# Altium project steering_wheel_unit.PrjPcb (part 2 of 2)

## Sheet io.SchDoc
size A2; SheetNumber: 3; SheetTotal: 4
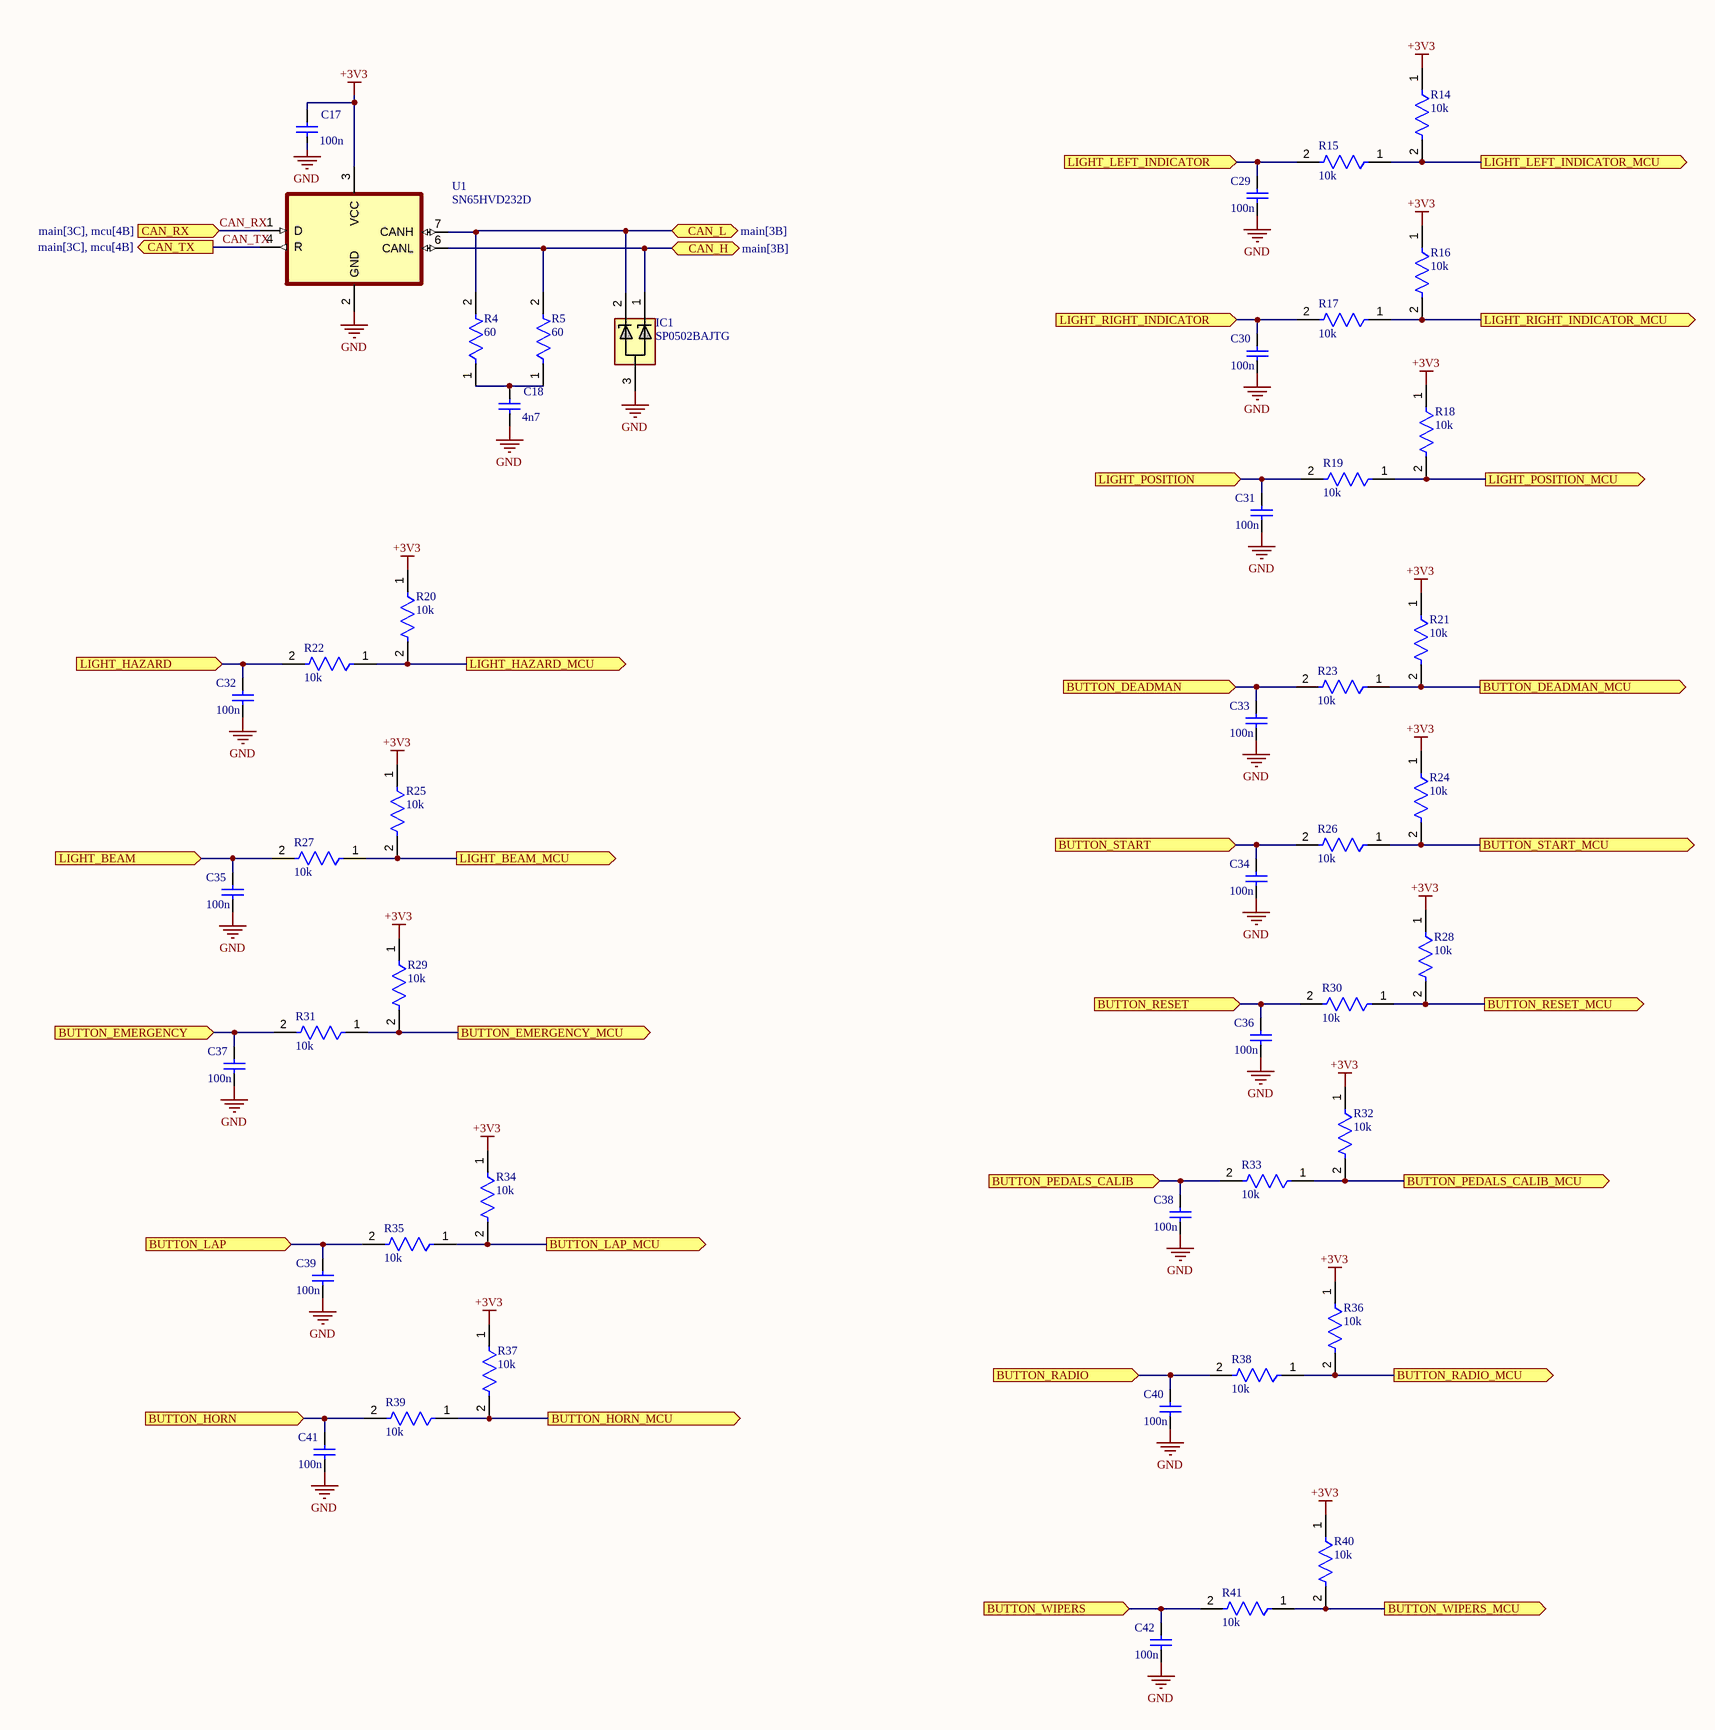
[diagram p2: io.SchDoc]

### Parts
C17  100n  [CAPC1206(3216)150_L]
C18  4n7  [CAPC1206(3216)150_L]
C29  100n  [CAPC1206(3216)150_L]
C30  100n  [CAPC1206(3216)150_L]
C31  100n  [CAPC1206(3216)150_L]
C32  100n  [CAPC1206(3216)150_L]
C33  100n  [CAPC1206(3216)150_L]
C34  100n  [CAPC1206(3216)150_L]
C35  100n  [CAPC1206(3216)150_L]
C36  100n  [CAPC1206(3216)150_L]
C37  100n  [CAPC1206(3216)150_L]
C38  100n  [CAPC1206(3216)150_L]
C39  100n  [CAPC1206(3216)150_L]
C40  100n  [CAPC1206(3216)150_L]
C41  100n  [CAPC1206(3216)150_L]
C42  100n  [CAPC1206(3216)150_L]
IC1  SP0502BAJTG  [SOT132P220X110-3N]
R4  60  [FP-RK73H2B-MFG]
R5  60  [FP-RK73H2B-MFG]
R14  10k  [FP-RK73H2B-MFG]
R15  10k  [FP-RK73H2B-MFG]
R16  10k  [FP-RK73H2B-MFG]
R17  10k  [FP-RK73H2B-MFG]
R18  10k  [FP-RK73H2B-MFG]
R19  10k  [FP-RK73H2B-MFG]
R20  10k  [FP-RK73H2B-MFG]
R21  10k  [FP-RK73H2B-MFG]
R22  10k  [FP-RK73H2B-MFG]
R23  10k  [FP-RK73H2B-MFG]
R24  10k  [FP-RK73H2B-MFG]
R25  10k  [FP-RK73H2B-MFG]
R26  10k  [FP-RK73H2B-MFG]
R27  10k  [FP-RK73H2B-MFG]
R28  10k  [FP-RK73H2B-MFG]
R29  10k  [FP-RK73H2B-MFG]
R30  10k  [FP-RK73H2B-MFG]
R31  10k  [FP-RK73H2B-MFG]
R32  10k  [FP-RK73H2B-MFG]
R33  10k  [FP-RK73H2B-MFG]
R34  10k  [FP-RK73H2B-MFG]
R35  10k  [FP-RK73H2B-MFG]
R36  10k  [FP-RK73H2B-MFG]
R37  10k  [FP-RK73H2B-MFG]
R38  10k  [FP-RK73H2B-MFG]
R39  10k  [FP-RK73H2B-MFG]
R40  10k  [FP-RK73H2B-MFG]
R41  10k  [FP-RK73H2B-MFG]
U1  SN65HVD232D  [SN65HVD232D]

### Ports
BUTTON_DEADMAN (in), BUTTON_DEADMAN_MCU (out), BUTTON_EMERGENCY (in), BUTTON_EMERGENCY_MCU (out), BUTTON_HORN (in), BUTTON_HORN_MCU (out), BUTTON_LAP (in), BUTTON_LAP_MCU (out), BUTTON_PEDALS_CALIB (in), BUTTON_PEDALS_CALIB_MCU (out), BUTTON_RADIO (in), BUTTON_RADIO_MCU (out), BUTTON_RESET (in), BUTTON_RESET_MCU (out), BUTTON_START (in), BUTTON_START_MCU (out), BUTTON_WIPERS (in), BUTTON_WIPERS_MCU (out), CAN_H (bidir, see main[3B]), CAN_L (bidir, see main[3B]), CAN_RX (in, see main[3C], mcu[4B]), CAN_TX (out, see main[3C], mcu[4B]), LIGHT_BEAM (in), LIGHT_BEAM_MCU (out), LIGHT_HAZARD (in), LIGHT_HAZARD_MCU (out), LIGHT_LEFT_INDICATOR (in), LIGHT_LEFT_INDICATOR_MCU (out), LIGHT_POSITION (in), LIGHT_POSITION_MCU (out), LIGHT_RIGHT_INDICATOR (in), LIGHT_RIGHT_INDICATOR_MCU (out)

### Nets
+3V3: C17.1 R14.1 R16.1 R18.1 R20.1 R21.1 R24.1 R25.1 R28.1 R29.1 R32.1 R34.1 R36.1 R37.1 R40.1 U1.3(VCC)
GND: C17.2 C18.2 C29.2 C30.2 C31.2 C32.2 C33.2 C34.2 C35.2 C36.2 C37.2 C38.2 C39.2 C40.2 C41.2 C42.2 IC1.3 U1.2(GND)
BUTTON_DEADMAN: C33.1 R23.2 ; port BUTTON_DEADMAN
BUTTON_EMERGENCY: C37.1 R31.2 ; port BUTTON_EMERGENCY
BUTTON_HORN: C41.1 R39.2 ; port BUTTON_HORN
BUTTON_LAP: C39.1 R35.2 ; port BUTTON_LAP
BUTTON_PEDALS_CALIB: C38.1 R33.2 ; port BUTTON_PEDALS_CALIB
BUTTON_RADIO: C40.1 R38.2 ; port BUTTON_RADIO
BUTTON_RESET: C36.1 R30.2 ; port BUTTON_RESET
BUTTON_START: C34.1 R26.2 ; port BUTTON_START
BUTTON_WIPERS: C42.1 R41.2 ; port BUTTON_WIPERS
CAN_H: IC1.1 R5.2 U1.6(CANL) ; port CAN_H
CAN_L: IC1.2 R4.2 U1.7(CANH) ; port CAN_L
CAN_RX: U1.1(D) ; port CAN_RX
CAN_TX: U1.4(R) ; port CAN_TX
LIGHT_BEAM: C35.1 R27.2 ; port LIGHT_BEAM
LIGHT_HAZARD: C32.1 R22.2 ; port LIGHT_HAZARD
LIGHT_LEFT_INDICATOR: C29.1 R15.2 ; port LIGHT_LEFT_INDICATOR
LIGHT_POSITION: C31.1 R19.2 ; port LIGHT_POSITION
LIGHT_RIGHT_INDICATOR: C30.1 R17.2 ; port LIGHT_RIGHT_INDICATOR
NetB1_8: R20.2 R22.1 ; port LIGHT_HAZARD_MCU
NetB1_9: R25.2 R27.1 ; port LIGHT_BEAM_MCU
NetB1_10: R18.2 R19.1 ; port LIGHT_POSITION_MCU
NetB1_11: R16.2 R17.1 ; port LIGHT_RIGHT_INDICATOR_MCU
NetB1_12: R14.2 R15.1 ; port LIGHT_LEFT_INDICATOR_MCU
NetB1_28: R32.2 R33.1 ; port BUTTON_PEDALS_CALIB_MCU
NetB1_29: R37.2 R39.1 ; port BUTTON_HORN_MCU
NetB1_30: R34.2 R35.1 ; port BUTTON_LAP_MCU
NetB1_31: R28.2 R30.1 ; port BUTTON_RESET_MCU
NetB1_32: R24.2 R26.1 ; port BUTTON_START_MCU
NetB1_33: R21.2 R23.1 ; port BUTTON_DEADMAN_MCU
NetB1_34: R29.2 R31.1 ; port BUTTON_EMERGENCY_MCU
NetB1_41: R36.2 R38.1 ; port BUTTON_RADIO_MCU
NetB1_42: R40.2 R41.1 ; port BUTTON_WIPERS_MCU
NetC18_1: C18.1 R4.1 R5.1

### Notes on the sheet
- DWG. NO.
- REV.
- SHT.
- REVISION
- DESCRIPTION
- DATE
- APPROVED
- THIS DOCUMENT AND THE DATA DISCLOSED HEREIN OR HEREWITH IS THE PROPERTY OF ALTIUM LIMITED AND MAY BE FREELY DISTRIBUTED IN WHOLE. NO RIGHTS ARE RESERVED OR EXPRESS OR IMPLIED WARANTEE GIVEN.
- ENG:
- DSN:
- APPROVALS
- PROJECT
- DOCUMENT REVISION:
- DESIGN ITEM:
- CHK:
- BOM:
- REFERENCE DOCUMENTS
- PROJECT REVISION:
- TITLE
- FAB DWG:
- PCB DWG:
- ASSY DWG:
- SCALE:
- SIZE
- C
- CAGE CODE
- FILE NAME
- DWG NO.
- SHEET
- OF
- REV

### Library data of the parts
C17 C18 C29-C42 = CMP-1037-04778-1: CAP 1.8uF 10V ±5% 1206 (3216 Metric) Thickness 1.45mm SMD; Case-EIA: 1206; Tolerance: Â±5%; Case-Metric: 3216; Technology: SMT; Value: 1.8uF; Rated Voltage: 10 V; Max Thickness: 1.45 mm
IC1 = SP0502BAJTG: Integrated Circuit; Manufacturer_Name: LITTELFUSE; Datasheet Link: https://www.littelfuse.com/~/media/electronics/datasheets/tvs_diode_arrays/littelfuse_tvs_diode_array_sp05_datasheet.pdf.pdf; Height: 1.1mm; Manufacturer_Part_Number: SP0502BAJTG; Mouser Part Number: 576-SP0502BAJTG; Mouser Price/Stock: https://www.mouser.co.uk/ProductDetail/Littelfuse/SP0502BAJTG?qs=RnOBYWd%2Fz7cttN1Mwg4HWA%3D%3D; Arrow Part Number: SP0502BAJTG; Arrow Price/Stock: https://www.arrow.com/en/products/sp0502bajtg/littelfuse?region=nac
R4 R5 R14-R41 = CMP-04015-098385-1: 40.2kΩ ±1% 0.25W Chip Resistor 1206 Thick Film AEC-Q200 Qualified; Resistance: 40.2kR; Voltage Rating (DC): 200V; Temperature Coefficient: 100ppm/°C; Power Rating: 250mW; Tolerance: 1%; Package Quantity: 5000; Length: 3.2mm; Termination: SMD/SMT; Lead Free: Contains Lead; Case Code (Imperial): 1206; Case/Package: 1206; Voltage Rating: 200V; Case Code (Metric): 3216; Max Operating Temperature: 155°C; Packaging: Tape and Reel; Width: 1.6mm; Series: RK73H; Min Operating Temperature: -55°C; RoHS Compliant: No; Height: 0.6mm
U1 = SN65HVD232D: Texas Instruments - SN65HVD232DR - Can Transceiver, 1MBPS, 1/1, 3.3V, SOIC-8, Full Reel; Manufacturer Lifecycle Status: ACTIVE; Max Supply Voltage: 3.6V; Min Supply Voltage: 3V; Nominal Supply Current: 17mA; Number of Drivers: 1; SnapEDA_Link: https://www.snapeda.com/parts/SN65HVD232D/Texas+Instruments/view-part/?ref=snap; Package: SOIC-8 Texas Instruments; Value: *; MF: Texas Instruments; MP: SN65HVD232D; Check_prices: https://www.snapeda.com/parts/SN65HVD232D/Texas+Instruments/view-part/?ref=eda; Supplier: Arrow Electronics; Supplier Part Number: SN65HVD232DR; Manufacturer: Texas Instruments; Manufacturer Part Number: SN65HVD232DR; RoHS: Compliant; Category: CAN Transceivers; Stock: 10000; Pricing: 2500=1,1159, 5000=1,076, 7500=1,062 (USD); Case/Package: SOIC; Data Rate: 1Mbps; Height: 1.75mm; Lead Free: Lead Free; Length: 4.9mm; Lifecycle Status: Production; Max Operating Temperature: 85°C; Min Operating Temperature: -40°C; Pins: 8; Number of Receive Buffers: 1; Number of Receivers: 1; Number of Transceivers: 1; Number of Transmit Buffers: 1; Packaging: Cut Tape; Radiation Hardening: No; REACH SVHC: No; Schedule B: 8542390000, 8542390000|8542390000|8542390000|8542390000|8542390000; Thickness: 1.58mm; Weight: 72.603129mg; Width: 3.91mm; ComponentLink1URL: https://octopart.com:443/opatz8j6/c1?t=KNMFt9M64p-_id6rZ0-P1CX6CGmvk_NFg0bt7DHXbi_P10EFF0MZE_9gM8ERckOxIywTBgDrXd4Bw1XwEAcVVdK92p9CEfdSNaVajf6_bxnez3EeN1RE1wZBaojbXTwQ_101S7Bb856c3hUAWErS0_zGIM1B6Z6dFQwv_Ps2SUdVVUCjmJkLnMLZKTBWfnIVcgJIheW78JYanUyW_1u-I93chBuiSPXQYIk2xXb9JgOyrE9lHEnesRSQq9luJOd1yknyGQP0N3Is0_dGM9QrGV5UOgjoada9tMnQwKJP8gahr3iTK59XJFH6OfbHTOm3R9BdESCrBMbrE2MVOGPPkVOTrqf0YMovDpmf-konbncFnSES8CNOhHqMwHv2HEwKcPoK44nl&src-supplier=Texas+Instruments; ComponentLink1Description: https://octopart.com:443/opatz8j6/c1?t=KNMFt9M64p-_id6rZ0-P1CX6CGmvk_NFg0bt7DHXbi_P10EFF0MZE_9gM8ERckOxIywTBgDrXd4Bw1XwEAcVVdK92p9CEfdSNaVajf6_bxnez3EeN1RE1wZBaojbXTwQ_101S7Bb856c3hUAWErS0_zGIM1B6Z6dFQwv_Ps2SUdVVUCjmJkLnMLZKTBWfnIVcgJIheW78JYanUyW_1u-I93chBuiSPXQYIk2xXb9JgOyrE9lHEnesRSQq9luJOd1yknyGQP0N3Is0_dGM9QrGV5UOgjoada9tMnQwKJP8gahr3iTK59XJFH6OfbHTOm3R9BdESCrBMbrE2MVOGPPkVOTrqf0YMovDpmf-konbncFnSES8CNOhHqMwHv2HEwKcPoK44nl&src-supplier=Texas+Instruments; ComponentLink2URL: https://sigma.octopart.com:443/49249642/technical_drawing/Texas-Instruments-SN65HVD232DR.pdf?src-supplier=Texas+Instruments; ComponentLink2Description: https://sigma.octopart.com:443/49249642/technical_drawing/Texas-Instruments-SN65HVD232DR.pdf?src-supplier=Texas+Instruments; ComponentLink3URL: https://datasheet.octopart.com:443/SN65HVD232DR-Texas-Instruments-datasheet-81447765.pdf?src-supplier=Upverter; ComponentLink3Description: https://datasheet.octopart.com:443/SN65HVD232DR-Texas-Instruments-datasheet-81447765.pdf?src-supplier=Upverter; ComponentLink4URL: https://datasheet.octopart.com:443/SN65HVD232DR-Texas-Instruments-datasheet-37140773.pdf?src-supplier=Newark; ComponentLink4Description: https://datasheet.octopart.com:443/SN65HVD232DR-Texas-Instruments-datasheet-37140773.pdf?src-supplier=Newark; ComponentLink5URL: https://datasheet.octopart.com:443/SN65HVD232DR-Texas-Instruments-datasheet-14436966.pdf?src-supplier=Newark; ComponentLink5Description: https://datasheet.octopart.com:443/SN65HVD232DR-Texas-Instruments-datasheet-14436966.pdf?src-supplier=Newark; ComponentLink6URL: https://datasheet.octopart.com:443/SN65HVD232DR-Texas-Instruments-datasheet-58296547.pdf?src-supplier=Newark; ComponentLink6Description: https://datasheet.octopart.com:443/SN65HVD232DR-Texas-Instruments-datasheet-58296547.pdf?src-supplier=Newark; ComponentLink7URL: https://datasheet.octopart.com:443/SN65HVD232DR-Texas-Instruments-datasheet-48117850.pdf?src-supplier=Newark; ComponentLink7Description: https://datasheet.octopart.com:443/SN65HVD232DR-Texas-Instruments-datasheet-48117850.pdf?src-supplier=Newark; ComponentLink8URL: https://datasheet.octopart.com:443/SN65HVD232DR-Texas-Instruments-datasheet-10256024.pdf?src-supplier=Arrow+Electronics; ComponentLink8Description: https://datasheet.octopart.com:443/SN65HVD232DR-Texas-Instruments-datasheet-10256024.pdf?src-supplier=Arrow+Electronics; ComponentLink9URL: https://datasheet.octopart.com:443/SN65HVD232DR-Texas-Instruments-datasheet-149765.pdf?src-supplier=Mouser; ComponentLink9Description: https://datasheet.octopart.com:443/SN65HVD232DR-Texas-Instruments-datasheet-149765.pdf?src-supplier=Mouser; ComponentLink10URL: https://datasheet.octopart.com:443/SN65HVD232DR-Texas-Instruments-datasheet-62292544.pdf?src-supplier=Farnell; ComponentLink10Description: https://datasheet.octopart.com:443/SN65HVD232DR-Texas-Instruments-datasheet-62292544.pdf?src-supplier=Farnell; ComponentLink11URL: https://datasheet.octopart.com:443/SN65HVD232DR-Texas-Instruments-datasheet-164416263.pdf?src-supplier=SHENGYU+ELECTRONICS; ComponentLink11Description: https://datasheet.octopart.com:443/SN65HVD232DR-Texas-Instruments-datasheet-164416263.pdf?src-supplier=SHENGYU+ELECTRONICS; ComponentLink12URL: https://datasheet.octopart.com:443/SN65HVD232DR-Texas-Instruments-datasheet-159115712.pdf?src-supplier=LCSC; ComponentLink12Description: https://datasheet.octopart.com:443/SN65HVD232DR-Texas-Instruments-datasheet-159115712.pdf?src-supplier=LCSC; ComponentLink13URL: https://datasheet.octopart.com:443/SN65HVD232DR-Texas-Instruments-datasheet-137316104.pdf?src-supplier=Future+Electronics; ComponentLink13Description: https://datasheet.octopart.com:443/SN65HVD232DR-Texas-Instruments-datasheet-137316104.pdf?src-supplier=Future+Electronics; ComponentLink14URL: https://datasheet.octopart.com:443/SN65HVD232DR-Texas-Instruments-datasheet-8625468.pdf?src-supplier=Verical; ComponentLink14Description: https://datasheet.octopart.com:443/SN65HVD232DR-Texas-Instruments-datasheet-8625468.pdf?src-supplier=Verical; ComponentLink15URL: https://datasheet.octopart.com:443/SN65HVD232DR-Texas-Instruments-datasheet-8378736.pdf?src-supplier=Verical; ComponentLink15Description: https://datasheet.octopart.com:443/SN65HVD232DR-Texas-Instruments-datasheet-8378736.pdf?src-supplier=Verical; ComponentLink16URL: http://sigma.octopart.com:80/conflict_mineral_statement/Texas-Instruments-company-63.pdf?src-supplier=Compliance+Statements; ComponentLink16Description: http://sigma.octopart.com:80/conflict_mineral_statement/Texas-Instruments-company-63.pdf?src-supplier=Compliance+Statements; ComponentLink17URL: http://sigma.octopart.com:80/reach_statement/Texas-Instruments-company-64.pdf?src-supplier=Compliance+Statements; ComponentLink17Description: http://sigma.octopart.com:80/reach_statement/Texas-Instruments-company-64.pdf?src-supplier=Compliance+Statements

## Sheet power.SchDoc
size A4; SheetNumber: 4; SheetTotal: 5
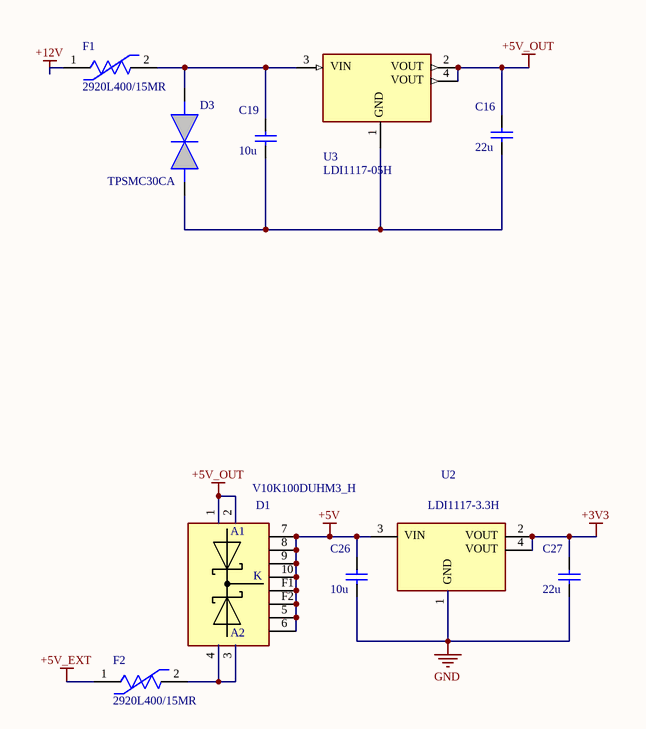
[diagram p3: power.SchDoc]

### Parts
C16  22u  [CAPC1206(3216)150_L]
C19  10u  [CAPC1206(3216)150_L]
C26  10u  [CAPC1206(3216)150_L]
C27  22u  [CAPC1206(3216)150_L]
D1  V10K100DUHM3_H  [V10K100DUHM3H]
D3  TPSMC30CA  [TPSMC30CA]
F1  2920L400/15MR  [FP-2920L400-15MR-MFG]
F2  2920L400/15MR  [FP-2920L400-15MR-MFG]
U2  LDI1117-3.3H  [LDI1117-3.3H]
U3  LDI1117-05H  [LDI1117-05H]

### Nets
+3V3: C27.1 U2.2 U2.4
+5V: C26.1 D1.5 D1.6 D1.7 D1.8 D1.9 D1.10 D1.F1 D1.F2 U2.3
+5V_EXT: F2.1
+5V_OUT: C16.1 D1.1 D1.2 U3.2 U3.4
+12V: F1.1
GND: C26.2 C27.2 U2.1
NetC16_2: C16.2 C19.2 D3.2(A)
NetC19_1: C19.1 D3.1(K) F1.2 U3.3
NetD1_3: D1.3 D1.4 F2.2

Not connected (* = marked no-connect by the designer): U3 1

### Notes on the sheet
- (in symbol LDI1117-3.3H) VIN; VOUT; GND
- (in symbol LDI1117-05H) VIN; VOUT; GND
- (in symbol V10K100DUHM3_H) A1; K; A2

### Library data of the parts
C16 C19 C26 C27 = CMP-1037-04778-1: as C17 on sheet io; Technology: SMT; Value: 1.8uF; Rated Voltage: 10 V; Max Thickness: 1.45 mm
D1 = V10K100DUHM3_H: Schottky Diodes & Rectifiers 10A 100V TMBS FlatPAK 5x6; Manufacturer_Name: Vishay; Manufacturer_Part_Number: V10K100DUHM3/H; Geometry.Height: 1.09mm; Mouser Part Number: 78-V10K100DUHM3/H; Mouser Price/Stock: https://www.mouser.co.uk/ProductDetail/Vishay-General-Semiconductor/V10K100DUHM3-H/?qs=u16ybLDytRayB9owesg4qQ%3D%3D; Arrow Part Number: *; Arrow Price/Stock: *; Datasheet Link: https://www.farnell.com/datasheets/2721061.pdf
D3 = TPSMC30CA: TPSMC Series - Surface Mount, 1500W TVS Diode-AEC-Q101 Qualified, 25.6V, 41.4V, DO-214AB, RoHS; Manufacturer_Name: Vishay; Manufacturer_Part_Number: VS-MBRS340-M3/9AT; Manufacturer: Littelfuse; Geometry.Height: 2.62mm; Breakdown Voltage: 30V; Max Breakdown Voltage: 31.5V; Max Power Dissipation: 6.5W; Max Reverse Leakage Current: 1µA; Max Surge Current: 36.7A; Min Breakdown Voltage: 28.5V; Number of Bidirectional Channels: 1; Peak Pulse Power: 1.5kW; Polarity: Bidirectional; Power Line Protection: No; Test Current: 1mA; Working Voltage: 3.5V; Mouser Part Number: 78-VS-MBRS340-M39AT; Mouser Price/Stock: https://www.mouser.co.uk/ProductDetail/Vishay-Semiconductors/VS-MBRS340-M3-9AT?qs=nc3S1USEIbv1XISTKnRMKw%3D%3D; Arrow Part Number: VS-MBRS340-M3/9AT; Arrow Price/Stock: https://www.arrow.com/en/products/vs-mbrs340-m39at/vishay?region=nac; Datasheet Link: https://componentsearchengine.com/Datasheets/1/VS-MBRS340-M3_9AT.pdf; Supplier: Farnell; Supplier Part Number: 3392487; Manufacturer Part Number: TPSMC30CA; RoHS: Compliant; Category: TVS Diodes; Stock: 2290; Clamping Voltage: 41.4V; Composition: Zener; Height: 2.62mm; Lead Free: Lead Free; Length: 7.11mm; Lifecycle Status: Production; Max Operating Temperature: 150°C; Min Operating Temperature: -65°C; Mounting Technology: Surface Mount; Number of Elements: 1; Number of Terminals: 2; Packaging: Digi-Reel®; Peak Pulse Current: 36.7A; Peak Reverse Current: 1µA; REACH SVHC: No; Reverse Standoff Voltage: 25.6V; Reverse Voltage: 25.6V; Schedule B: 8541100080; Termination: SMD/SMT; Weight: 210.013267mg; Width: 6.22mm; ComponentLink1URL: https://datasheet.octopart.com:443/TPSMC30CA-Littelfuse-datasheet-180609796.pdf?src-supplier=IHS; ComponentLink1Description: https://datasheet.octopart.com:443/TPSMC30CA-Littelfuse-datasheet-180609796.pdf?src-supplier=IHS; ComponentLink2URL: https://datasheet.octopart.com:443/TPSMC30CA-Littelfuse-datasheet-140259240.pdf?src-supplier=Newark; ComponentLink2Description: https://datasheet.octopart.com:443/TPSMC30CA-Littelfuse-datasheet-140259240.pdf?src-supplier=Newark; ComponentLink3URL: https://datasheet.octopart.com:443/TPSMC30CA-Littelfuse-datasheet-104627261.pdf?src-supplier=Littelfuse+SCT; ComponentLink3Description: https://datasheet.octopart.com:443/TPSMC30CA-Littelfuse-datasheet-104627261.pdf?src-supplier=Littelfuse+SCT; ComponentLink4URL: https://datasheet.octopart.com:443/TPSMC30CA-Littelfuse-datasheet-36859614.pdf?src-supplier=Fuses+Unlimited; ComponentLink4Description: https://datasheet.octopart.com:443/TPSMC30CA-Littelfuse-datasheet-36859614.pdf?src-supplier=Fuses+Unlimited; ComponentLink5URL: https://datasheet.octopart.com:443/TPSMC30CA-Littelfuse-datasheet-178249297.pdf?src-supplier=Burklin+Elektronik; ComponentLink5Description: https://datasheet.octopart.com:443/TPSMC30CA-Littelfuse-datasheet-178249297.pdf?src-supplier=Burklin+Elektronik
F1 F2 = CMP-08606-000010-2: PTC RESET FUSE 15V 4A 2920; Max Current Rating: 40A; Time to Trip: 4s; Trip Current: 8A; Approvals: TUV; Min Operating Temperature: -40°C; Packaging: Tape and Reel; Case Code (Metric): 7351; Hold Current: 4A; Max Operating Temperature: 85°C; Case Code (Imperial): 2920; Mount: Surface Mount
U2 = LDI1117-3.3H: Fixed Positive LDO Regulator; Manufacturer: Diotec; Supplier: Mouser; Supplier Part Number: 637-LDI1117-3.3H; Manufacturer Part Number: LDI1117-3.3H; RoHS: No; Category: Voltage Regulators - Linear; Stock: 5056; Pricing: 1=0,4, 10=0,286, 50=0,286, 100=0,199, 1000=0,163, 10000=0,089 (USD); ComponentLink1URL: https://datasheet.octopart.com/LDI1117-3.3H-Diotec-datasheet-154607892.pdf?src-supplier=TME; ComponentLink1Description: https://datasheet.octopart.com/LDI1117-3.3H-Diotec-datasheet-154607892.pdf?src-supplier=TME; ComponentLink2URL: https://datasheet.octopart.com/LDI1117-3.3H-Diotec-datasheet-159101088.pdf?src-supplier=SOS+electronic; ComponentLink2Description: https://datasheet.octopart.com/LDI1117-3.3H-Diotec-datasheet-159101088.pdf?src-supplier=SOS+electronic; ComponentLink3URL: https://datasheet.octopart.com/LDI1117-3.3H-Diotec-datasheet-189099648.pdf?src-supplier=Master+Electronics; ComponentLink3Description: https://datasheet.octopart.com/LDI1117-3.3H-Diotec-datasheet-189099648.pdf?src-supplier=Master+Electronics
U3 = LDI1117-05H: Fixed Positive LDO Regulator; Manufacturer: Diotec; Supplier: Farnell; Supplier Part Number: 4553249; Manufacturer Part Number: LDI1117-05H; RoHS: No; Category: Voltage Regulators - Linear; Stock: 720; RoHS Compliant: Yes; ComponentLink1URL: http://datasheet.octopart.com/LDI1117-05H-Diotec-datasheet-154607892.pdf?src-supplier=Mouser; ComponentLink1Description: http://datasheet.octopart.com/LDI1117-05H-Diotec-datasheet-154607892.pdf?src-supplier=Mouser; ComponentLink2URL: http://datasheet.octopart.com/LDI1117-05H-Diotec-datasheet-154607892.pdf?src-supplier=Distrelec; ComponentLink2Description: http://datasheet.octopart.com/LDI1117-05H-Diotec-datasheet-154607892.pdf?src-supplier=Distrelec; ComponentLink3URL: http://datasheet.octopart.com/LDI1117-05H-Diotec-datasheet-154607892.pdf?src-supplier=Onlinecomponents.com; ComponentLink3Description: http://datasheet.octopart.com/LDI1117-05H-Diotec-datasheet-154607892.pdf?src-supplier=Onlinecomponents.com; ComponentLink4URL: http://datasheet.octopart.com/LDI1117-05H-Diotec-datasheet-154607892.pdf?src-supplier=DComponents; ComponentLink4Description: http://datasheet.octopart.com/LDI1117-05H-Diotec-datasheet-154607892.pdf?src-supplier=DComponents; ComponentLink5URL: https://datasheet.octopart.com/LDI1117-05H-Diotec-datasheet-154607892.pdf?src-supplier=TME; ComponentLink5Description: https://datasheet.octopart.com/LDI1117-05H-Diotec-datasheet-154607892.pdf?src-supplier=TME; ComponentLink6URL: https://datasheet.octopart.com/LDI1117-05H-Diotec-datasheet-159101088.pdf?src-supplier=SOS+electronic; ComponentLink6Description: https://datasheet.octopart.com/LDI1117-05H-Diotec-datasheet-159101088.pdf?src-supplier=SOS+electronic; ComponentLink7URL: http://datasheet.octopart.com/LDI1117-05H-Diotec-datasheet-154607892.pdf?src-supplier=Electro+Sonic; ComponentLink7Description: http://datasheet.octopart.com/LDI1117-05H-Diotec-datasheet-154607892.pdf?src-supplier=Electro+Sonic; ComponentLink8URL: https://datasheet.octopart.com/LDI1117-05H-Diotec-datasheet-189099648.pdf?src-supplier=Master+Electronics; ComponentLink8Description: https://datasheet.octopart.com/LDI1117-05H-Diotec-datasheet-189099648.pdf?src-supplier=Master+Electronics

## Nets that join several sheets
+3V3: main (6 pins), mcu (16 pins), io (16 pins), power (C27.1 U2.2 U2.4)
+5V_EXT: main (J2.2), power (F2.1)
+12V: main (J1.2), power (F1.1)
GND: main (20 pins), mcu (31 pins), io (18 pins), power (C26.2 C27.2 U2.1)
BUTTON_DEADMAN: main (J12.1), io (C33.1 R23.2)
BUTTON_EMERGENCY: main (J11.1), io (C37.1 R31.2)
BUTTON_HORN: main (J16.1), io (C41.1 R39.2)
BUTTON_LAP: main (J14.1), io (C39.1 R35.2)
BUTTON_PEDALS_CALIB: main (J17.1), io (C38.1 R33.2)
BUTTON_RADIO: main (J18.1), io (C40.1 R38.2)
BUTTON_RESET: main (J15.1), io (C36.1 R30.2)
BUTTON_START: main (J13.1), io (C34.1 R26.2)
BUTTON_WIPERS: main (J19.1), io (C42.1 R41.2)
CAN_H: main (J3.5), io (IC1.1 R5.2 U1.6)
CAN_L: main (J3.1), io (IC1.2 R4.2 U1.7)
CAN_RX: mcu (B1.26), io (U1.1)
CAN_TX: mcu (B1.27), io (U1.4)
JTAG_RESET: main (J4.3), mcu (5 pins)
JTAG_SWCLK: main (J4.4), mcu (B1.38)
JTAG_SWDIO: main (J4.2), mcu (B1.37)
JTAG_SWO: main (J4.6), mcu (B1.40)
LCD_DC: main (J8.5), mcu (B1.18)
LCD_RST: main (J8.6), mcu (B1.17)
LCD_SPI_MISO: main (J8.1), mcu (B1.14)
LCD_SPI_MOSI: main (J8.4), mcu (B1.15)
LCD_SPI_SCLK: main (J8.3), mcu (B1.13)
LIGHT_BEAM: main (J9.1), io (C35.1 R27.2)
LIGHT_HAZARD: main (J6.1), io (C32.1 R22.2)
LIGHT_LEFT_INDICATOR: main (J7.3), io (C29.1 R15.2)
LIGHT_POSITION: main (J10.1), io (C31.1 R19.2)
LIGHT_RIGHT_INDICATOR: main (J7.1), io (C30.1 R17.2)
NetB1_8: mcu (B1.8), io (R20.2 R22.1)
NetB1_9: mcu (B1.9), io (R25.2 R27.1)
NetB1_10: mcu (B1.10), io (R18.2 R19.1)
NetB1_11: mcu (B1.11), io (R16.2 R17.1)
NetB1_12: mcu (B1.12), io (R14.2 R15.1)
NetB1_28: mcu (B1.28), io (R32.2 R33.1)
NetB1_29: mcu (B1.29), io (R37.2 R39.1)
NetB1_30: mcu (B1.30), io (R34.2 R35.1)
NetB1_31: mcu (B1.31), io (R28.2 R30.1)
NetB1_32: mcu (B1.32), io (R24.2 R26.1)
NetB1_33: mcu (B1.33), io (R21.2 R23.1)
NetB1_34: mcu (B1.34), io (R29.2 R31.1)
NetB1_41: mcu (B1.41), io (R36.2 R38.1)
NetB1_42: mcu (B1.42), io (R40.2 R41.1)
UART_RX: main (J5.5), mcu (B1.25)
UART_TX: main (J5.3), mcu (B1.22)